# Altium schematic sheet Sheet_1_2022-03-10.schdoc
size 71 x 51 mm
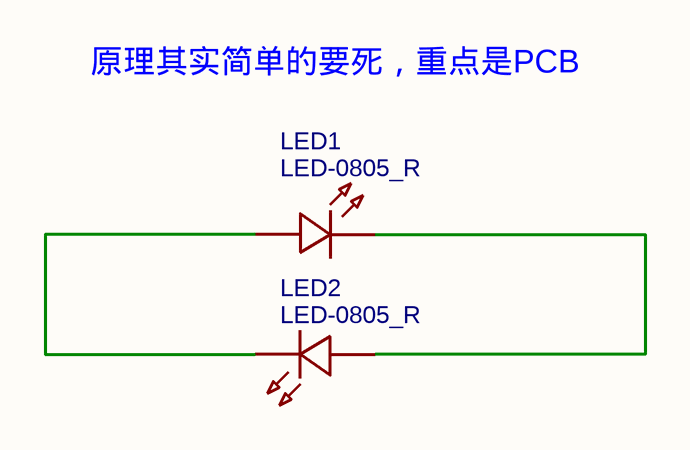
[diagram p0: Sheet_1_2022-03-10.schdoc]

## Parts
LED1  LED-0805_R  [LED0805_RED]
LED2  LED-0805_R  [LED0805_RED]

## Nets
NetLED1_1: LED1.1 LED2.2
NetLED1_2: LED1.2 LED2.1

## Notes on the sheet
- 原理其实简单的要死，重点是PCB

## Library data of the parts
LED1 LED2 = LED-0805_R: BOM_Manufacturer: EVERLIGHT(台湾亿光); BOM_Manufacturer Part: 17-21SURC/S530-A3/TR8; Contributor: LCEDA_Lib; BOM_Supplier Part: C72037; spicePre: L; spiceSymbolName: LED-0805_R